# EAGLE design PAM2320_Breakout (EAGLE 9.6.2)
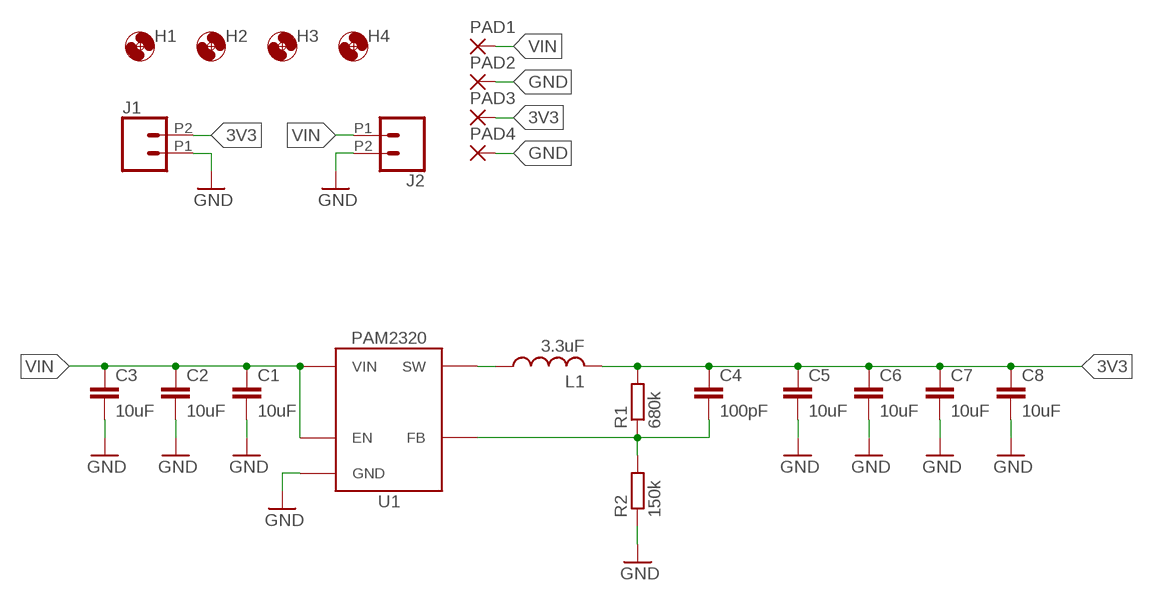
[diagram p0: schematic, sheet 1]

## Parts
C1  10uF  C-EU10UFC0805  [C0805]
C2  10uF  C-EU10UFC0805  [C0805]
C3  10uF  C-EU10UFC0805  [C0805]
C4  100pF  C-EUC0603  [C0603]
C5  10uF  C-EU10UFC0805  [C0805]
C6  10uF  C-EU10UFC0805  [C0805]
C7  10uF  C-EU10UFC0805  [C0805]
C8  10uF  C-EU10UFC0805  [C0805]
H1  MOUNTING_HOLE2_NP  [2_56]
H2  MOUNTING_HOLE2_NP  [2_56]
H3  MOUNTING_HOLE2_NP  [2_56]
H4  MOUNTING_HOLE2_NP  [2_56]
J1  CONN_022.54_SCREW_ROUND  [1X02_2.54_SCREWTERM_ROUND]
J2  CONN_022.54_SCREW_ROUND  [1X02_2.54_SCREWTERM_ROUND]
L1  3.3uF  INDUCTOR_MAPI_5.4X5.4  [WE-MAPI(5.4X5.4)]
PAD1  SMD5  [SMD2,54-5,08]
PAD2  SMD5  [SMD2,54-5,08]
PAD3  SMD5  [SMD2,54-5,08]
PAD4  SMD5  [SMD2,54-5,08]
R1  680k  R-EU_R0603  [R0603]
R2  150k  R-EU_R0603  [R0603]
U1  PAM2320  [PSOP-8]

## Nets
3V3: C4.1 C5.1 C6.1 C7.1 C8.1 J1.P2 L1.P$2 PAD3.1(P) R1.2
FB: C4.2 R1.1 R2.2 U1.5(FB)
GND: C1.2 C2.2 C3.2 C5.2 C6.2 C7.2 C8.2 J1.P1 J2.P2 PAD2.1(P) PAD4.1(P) R2.1 U1.4(GND) U1.EP(GND)
SW: L1.P$1 U1.3(SW)
VIN: C1.1 C2.1 C3.1 J2.P1 PAD1.1(P) U1.2(VIN) U1.7(EN)

## Library data of the parts
C1-C3 C5-C8 = bschulz_passives:C-EU: CAPACITOR, European symbol; DIGIKEY: 490-6473-1-ND; MF: Murata; MPN: GRM21BR61C106KE15K
C4 = bschulz_passives:C-EU: CAPACITOR, European symbol
H1-H4 = bschulz:MOUNTING_HOLE: Genaric Mechanical Mounting Hole Hole diameter based on max body diameter + 15% Keepout ring is for diameter of socket cap screw (minimum required clearance) TPlace ring is for diameter of pan head screw (recomended clearance) Specifications: Socket Cap <http://fastener-express.com/fastener-technical/SocketscapSS-Alloy.pdf> Button Head Socket Cap <http://fastener-express.com/fastener-technical/Button-Socket-alloy.pdf> Pan Head <http://fastener-express.com/fastener-technical/pan-machine-Screws.pdf>; DIGIKEY: DNP; MF: N/A; MPN: DNP
J1 J2 = bschulz:CONN_02: Genaric 2 terminal header SCREW_2.54 <https://www.digikey.com/product-detail/en/on-shore-technology-inc/OSTVN02A150/ED10561-ND/1588862> 39532_RA <https://www.digikey.com/product-detail/en/molex/0395321002/WM7845-ND/1280696>; DIGIKEY: ED10561-ND; MF: OnShore; MPN: OSTVN02A150
L1 = bschulz:INDUCTOR: Genaric inductor
PAD1-PAD4 = wirepad:SMD5: SMD PAD
R1 R2 = bschulz_passives:R-EU_: RESISTOR, European symbol Digikey Parts: Yageo, 0402 <https://www.digikey.com/products/en/resistors/chip-resistor-surface-mount/52?k=&pkeyword=&sv=0&s=4356&sf=1&FV=-1%7C13%2C7%7C2%2C1291%7C39157%2C1989%7C0%2C-8%7C52%2C3%7C1131%2C3%7C2503&quantity=&ColumnSort=0&page=1&stock=1&pageSize=25> Yageo, 0603 <https://www.digikey.com/products/en/resistors/chip-resistor-surface-mount/52?k=&pkeyword=&sv=0&pv1291=39245&sf=1&FV=-5%7C4356%2C-5%7C47360%2C-8%7C52%2C-1%7C13%2C7%7C2%2C1989%7C0&quantity=10&ColumnSort=1000011&page=1&stock=1&pageSize=25> Panasonic, 0603 <https://www.digikey.com/products/en/resistors/chip-resistor-surface-mount/52?k=&pkeyword=&pv252=68&sf=0&FV=ffec373d%2C1c0002%2C142c040c%2C1f140000%2Cffe00034%2C80002%2Cc0001&quantity=&ColumnSort=0&page=1&stock=1&pageSize=25> Panasonic, precision, 0603 <https://www.digikey.com/products/en/resistors/chip-resistor-surface-mount/52?FV=ffec4907%2Cfffc000a%2Cc0172%2C142c040c%2C1f140000%2Cffe00034%2C1c0002&quantity=100&ColumnSort=2085&page=1&stock=1&pageSize=25> Panasonic, 0805 <https://www.digikey.com/products/en/resistors/chip-resistor-surface-mount/52?k=&pkeyword=&pv3=1&sf=0&FV=ffec373d%2C1c0002%2C1f140000%2Cffe00034%2C142c040d&quantity=&ColumnSort=0&page=1&stock=1&pageSize=25> Rohm, current sense <https://www.digikey.com/products/en/resistors/chip-resistor-surface-mount/52?k=&pkeyword=&pv3=1&sf=0&FV=ffecb688%2C1f140000%2Cffe00034%2C1c0002&quantity=&ColumnSort=0&page=1&stock=1&pageSize=25> Vishay, pulse proof automotive <https://www.digikey.com/products/en/resistors/chip-resistor-surface-mount/52?k=&pkeyword=&pv7=2&sf=0&FV=ffec5d6b%2Cffe00034%2C1f140000&quantity=&ColumnSort=0&page=1&stock=1&pageSize=25>; MF: Yageo
U1 = bschulz:PAM2320: PAM2320 - Low noise Step-Down DC-DC Converter Characteristics: Vin: 2.7V ~ 5.5V Vout: 0.6V ~ Vin Iout: 3A IQ: <1μA Operating Temperature: -40°C to 85°C Digikey: PAM2320BECADJRDICT-ND <https://www.digikey.com/en/products/detail/diodes-incorporated/PAM2320BECADJR/4033249>; DIGIKEY: PAM2320BECADJRDICT-ND; MF: Diodes Inc; MPN: PAM2320BECADJR

## Board
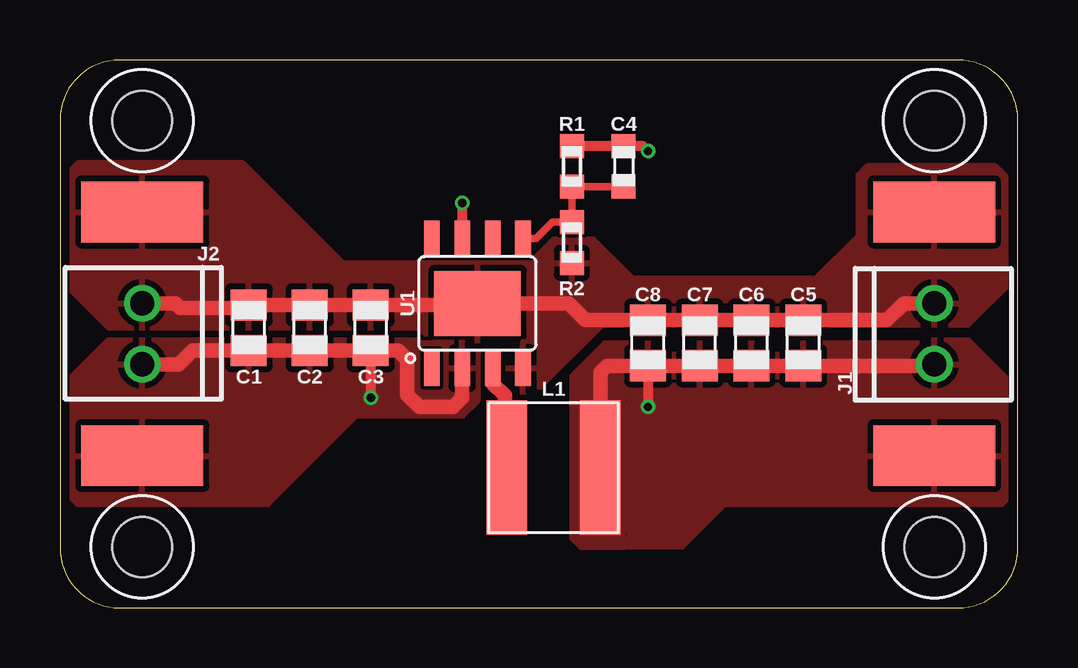
[diagram p1: board, top side]
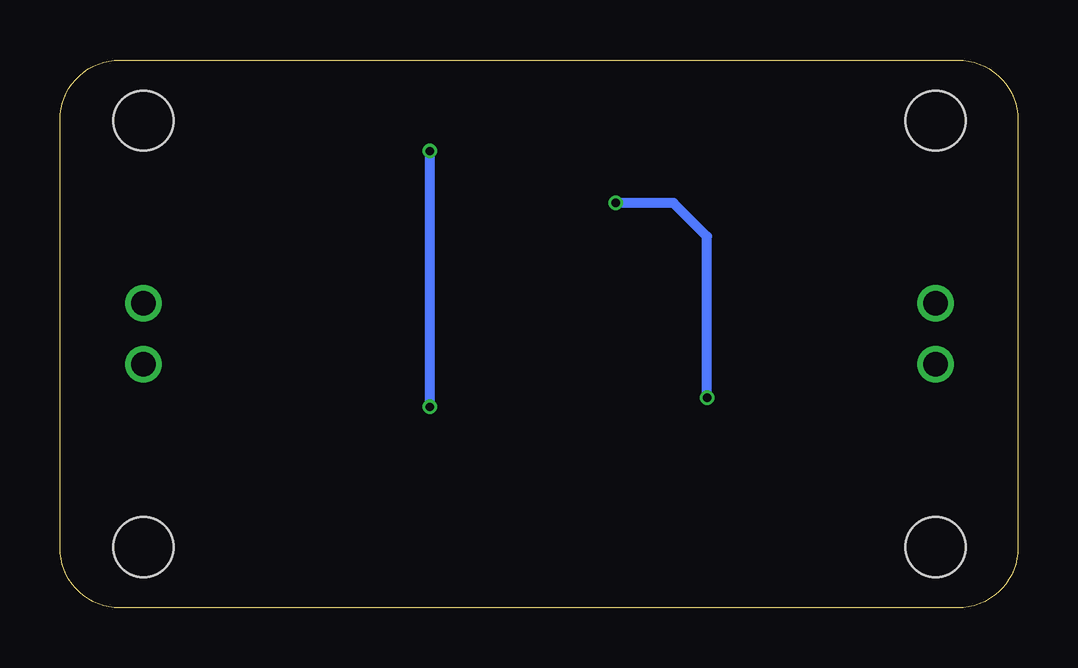
[diagram p2: board, bottom side, seen from below]

Size 39.93 x 22.85 mm. Coordinates in mm from the lower left corner, seen from the top.
Outline: 37.43,22.85 2.5,22.85 arc90 0,20.35 0,2.5 arc90 2.5,0 37.43,0 arc90 39.93,2.5 39.93,20.35 arc90 37.43,22.85
Copper layers (1*16): Top 0.035559375mm / dielectric 1.6mm / Bottom 0.035559375mm
Design rules "oshpark-2layer": minimum track width 6mil, minimum drill 10mil, track to track 6mil, track to pad 6mil, pad to pad 6mil, via to via 6mil, smd to smd 6mil, copper to edge 15mil, drill to drill 6mil, minimum pad ring 5mil, minimum via ring 5mil, stop-mask expansion 2.5mil, vias tented up to drill 0mil, thermal gap 10mil

### Footprints (pad centres in the part's own frame; a part is rotated, then mirrored left to right if it is on the bottom)
C0805 = smd 1.3 x 1.5: 1 -0.95,0; 2 0.95,0
C0603 = smd 1 x 1: 1 -0.85,0; 2 0.85,0
2_56 = hole 2.5: 0,0
1X02_2.54_SCREWTERM_ROUND = drill 1.016: P1 1.27,0; P2 -1.27,0
WE-MAPI(5.4X5.4) = smd 1.7 x 5.6: P$1 -1.95,0; P$2 1.95,0
SMD2,54-5,08 = smd 2.54 x 5.08: 1 0,0
R0603 = smd 1 x 1: 1 -0.85,0; 2 0.85,0
PSOP-8 = smd 1.5 x 0.65: 1 -2.7,1.905; 2 -2.7,0.635; 3 -2.7,-0.635; 4 -2.7,-1.905; 5 2.7,-1.905; 6 2.7,-0.635; 7 2.7,0.635; 8 2.7,1.905 | smd 2.7 x 3.6: EP 0,0

### Placement (x,y rotation side)
C1  7.87,11.68 90 top
C2  10.41,11.68 90 top
C3  12.95,11.68 90 top
C4  23.5,18.41 270 top
C5  28.83,11.05 90 top
C6  26.67,11.05 90 top
C7  24.51,11.05 90 top
C8  30.99,11.05 90 top
H1  3.43,2.54 0 top
H2  36.45,2.54 0 top
H3  3.43,20.32 0 top
H4  36.45,20.32 0 top
J1  36.45,11.43 90 top
J2  3.43,11.43 270 top
L1  20.57,5.84 0 top
PAD1  3.43,6.35 90 top
PAD2  3.43,16.51 90 top
PAD3  36.45,6.35 90 top
PAD4  36.45,16.51 90 top
R1  21.34,18.41 90 top
R2  21.34,15.24 90 top
U1  17.4,12.7 90 top

### Tracks (layer width: path | path; a pad name or v marks a point on that pad's centre or on a via)
3V3  (via drill 0.35)
  Top 0.406: C7.1 v24.51,8.38 | v24.51,19.05 24.3,19.27 C4.1 R1.2
  Top 0.61: L1.P$2 22.52,9.82 22.8,10.1 C7.1 C6.1 C5.1 C8.1 36.39,10.1 J1.P2
  Bottom 0.406: v24.51,8.38 v24.51,19.05
  pour Top (rank 2): 23.59,2.54 23.5,2.67 23.5,8.89 22.73,11.05 35.94,11.05 36.07,11.18 37.85,11.18 40.13,8.89 40.13,5.21 39.24,4.32 27.69,4.32 25.91,2.54
  pour Top (rank 2, no thermals): 23.5,8.76 22.73,11.05 21.34,9.65 21.34,2.92 21.72,2.54 23.5,2.54
FB
  Top 0.305: C4.2 R1.1 R2.2 20.54,16.09 19.84,15.4 U1.5
GND
  Top 0.61: J2.P2 4.83,12.7 5.02,12.51 7.75,12.51 C1.2 C2.2 C3.2 17.33,12.63 U1.EP 21.21,12.7 21.91,12 C7.2 C6.2 C5.2 C8.2 34.48,12 35.18,12.7 J1.P1
  pour Top: 2.03,11.68 14.99,11.68 15.49,11.18 18.54,11.18 18.67,11.05 18.67,9.27 18.92,9.02 19.81,9.02 22.61,11.81 37.85,11.81 39.75,13.72 39.75,17.65 38.99,18.41 33.66,18.41 33.27,18.03 33.27,15.49 31.5,13.72 23.88,13.72 22.23,15.37 20.57,15.37 19.56,14.35 11.81,14.35 7.62,18.54 0.76,18.54 0.51,18.29 0.51,13.21
SW
  Top 0.61: L1.P$1 18.62,6.48 18.54,6.56 18.54,8.86 18.03,9.37 U1.3
VIN  (via drill 0.35)
  Top 0.406: C3.1 v12.95,8.76 | v16.76,16.89 U1.7
  Top 0.61: U1.2 16.76,8.76 16.38,8.38 14.99,8.38 14.48,8.89 14.48,10.35 14.1,10.73 C3.1 C2.1 C1.1 5.53,10.73 4.95,10.16 J2.P1
  Bottom 0.406: v12.95,8.76 12.95,15.49 14.35,16.89 v16.76,16.89
  pour Top (rank 2): 0.38,9.53 2.03,11.18 16.89,11.18 17.4,10.67 17.4,8.64 16.76,8 12.32,8 8.64,4.32 0.76,4.32 0.38,4.7

### Text on the board
tDocu: PAM2320 Breakout / v0.0 / B. Schulz | - | - | + | + | Break44 | Input | Output